# Altium schematic sheet Power_Regulators_Digital_3.SchDoc
size A4; DocumentNumber: 32; SheetNumber: 32; SheetTotal: 47
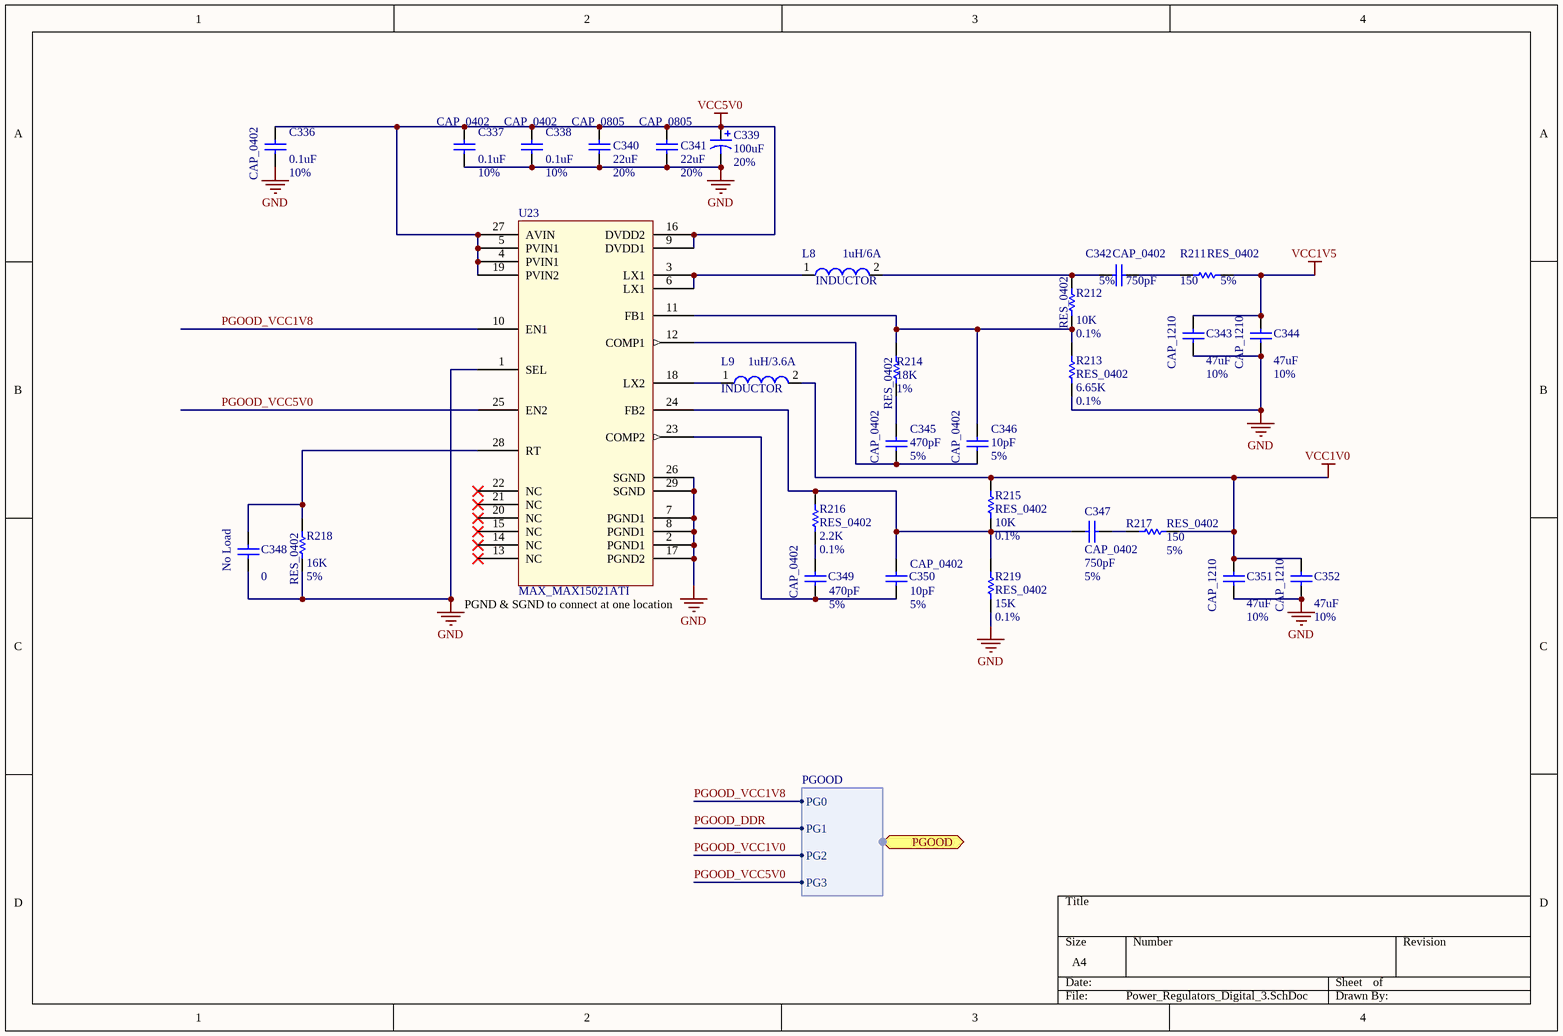
[diagram p0: Power_Regulators_Digital_3.SchDoc]

## Parts
C336  CAP_0402  value 0.1uF  Tolerance: 10%  [CAPC0402(1005)60_N]
C337  CAP_0402  value 0.1uF  Tolerance: 10%  [CAPC0402(1005)60_N]
C338  CAP_0402  value 0.1uF  Tolerance: 10%  [CAPC0402(1005)60_N]
C339  value 100uF  Tolerance: 20%  [Polarized_CAPC1210(3225)]  (hidden comment: Cap Pol1)
C340  CAP_0805  value 22uF  Tolerance: 20%  [CAPC0805(2012)75_N]
C341  CAP_0805  value 22uF  Tolerance: 20%  [CAPC0805(2012)75_N]
C342  CAP_0402  value 750pF  Tolerance: 5%  [CAPC0402(1005)60_N]
C343  CAP_1210  value 47uF  Tolerance: 10%  [CAPC1210(3225)100_N]
C344  CAP_1210  value 47uF  Tolerance: 10%  [CAPC1210(3225)100_N]
C345  CAP_0402  value 470pF  Tolerance: 5%  [CAPC0402(1005)60_N]
C346  CAP_0402  value 10pF  Tolerance: 5%  [CAPC0402(1005)60_N]
C347  CAP_0402  value 750pF  Tolerance: 5%  [CAPC0402(1005)60_N]
C348  value 0  Manufacturer: No Load  [CAPC0201(0603)33_N]  (hidden comment: CAP_0201)
C349  CAP_0402  value 470pF  Tolerance: 5%  [CAPC0402(1005)60_N]
C350  CAP_0402  value 10pF  Tolerance: 5%  [CAPC0402(1005)60_N]
C351  CAP_1210  value 47uF  Tolerance: 10%  [CAPC1210(3225)100_N]
C352  CAP_1210  value 47uF  Tolerance: 10%  [CAPC1210(3225)100_N]
L8  INDUCTOR  value 1uH/6A  [Inductor_SRN6045-Series_2-PIN]
L9  INDUCTOR  value 1uH/3.6A  [Inductor_NRS5020T1R0NMGJ_2-PIN]
R211  RES_0402  value 150  Tolerance: 5%  [RESC0402(1005)_N]
R212  RES_0402  value 10K  Tolerance: 0.1%  [RESC0402(1005)_N]
R213  RES_0402  value 6.65K  Tolerance: 0.1%  [RESC0402(1005)_N]
R214  RES_0402  value 18K  Tolerance: 1%  [RESC0402(1005)_N]
R215  RES_0402  value 10K  Tolerance: 0.1%  [RESC0402(1005)_N]
R216  RES_0402  value 2.2K  Tolerance: 0.1%  [RESC0402(1005)_N]
R217  RES_0402  value 150  Tolerance: 5%  [RESC0402(1005)_N]
R218  RES_0402  value 16K  Tolerance: 5%  [RESC0402(1005)_N]
R219  RES_0402  value 15K  Tolerance: 0.1%  [RESC0402(1005)_N]
U23  MAX_MAX15021ATI  [MAX_MAX15021ATI_28TQFN_T2855-6]

## Ports
PGOOD (harness PGOOD)

## Harnesses
PGOOD: PG0, PG1, PG2, PG3

## Nets
GND: C336.1 C337.1 C338.1 C339.2 C340.1 C341.1 C343.1 C344.1 C348.1 C351.1 C352.1 R213.1 R218.2 R219.1 U23.1(SEL) U23.2(PGND1) U23.7(PGND1) U23.8(PGND1) U23.17(PGND2) U23.26(SGND) U23.29(SGND)
VCC1V0: C351.2 C352.2 L9.2 R215.2 R217.2
VCC1V5: C343.2 C344.2 R211.2
VCC5V0: C336.2 C337.2 C338.2 C339.1 C340.2 C341.2 U23.4(PVIN1) U23.5(PVIN1) U23.9(DVDD1) U23.16(DVDD2) U23.19(PVIN2) U23.27(AVIN)
PGOOD_DDR: port PGOOD.PG1
PGOOD_VCC1V0: port PGOOD.PG2
PGOOD_VCC1V8: U23.10(EN1) ; port PGOOD.PG0
PGOOD_VCC5V0: U23.25(EN2) ; port PGOOD.PG3
NetC342_1: C342.1 L8.2 R212.2
NetC342_2: C342.2 R211.1
NetC345_1: C345.1 C346.1 U23.12(COMP1)
NetC345_2: C345.2 R214.1
NetC346_2: C346.2 R212.1 R213.2 R214.2 U23.11(FB1)
NetC347_1: C347.1 C350.2 R215.1 R216.2 R219.2 U23.24(FB2)
NetC347_2: C347.2 R217.1
NetC348_2: C348.2 R218.1 U23.28(RT)
NetC349_1: C349.1 C350.1 U23.23(COMP2)
NetC349_2: C349.2 R216.1
NetL8_1: L8.1 U23.3(LX1) U23.6(LX1)
NetL9_1: L9.1 U23.18(LX2)

Not connected (* = marked no-connect by the designer): U23 13(NC)* 14(NC)* 15(NC)* 20(NC)* 21(NC)* 22(NC)*

## Notes on the sheet
- (near U23) PGND & SGND to connect at one location

## Library data of the parts
C336-C338 = C1005X5R0J104K: 0.1uf, ceramic, 10%, 6.3V, X5R, 0402; Manufacturer: TDK Corporation; Part Number: C1005X5R0J104K; Footprint Ref: CAPC0402(1005)60_N; Library Ref: CAP_0402
C339 = TLCT107M010XTA: 100uF, tantalum, 20% 10V, 1210; Manufacturer: AVX Corporation; Part Number: TLCT107M010XTA; Footprint Ref: Polarized_CAPC1210(3225); Library Ref: Cap Pol1
C340 C341 = JMK212BJ226MG-T: 22uF, ceramic, 20%, 6.3V, X5R, 0805; Manufacturer: Taiyo Yuden; Part Number: JMK212BJ226MG-T; Footprint Ref: CAPC0805(2012)75_N; Library Ref: CAP_0805
C342 C347 = C0402C751J3GACTU: 750pF, ceramic, 5% 25V NP0, 0402; Manufacturer: Kemet; Part Number: C0402C751J3GACTU; Footprint Ref: CAPC0402(1005)60_N; Library Ref: CAP_0402
C343 C344 C351 C352 = GRM32ER61A476KE20L: 47uF, ceramic 10% 10V, X5R, 1210; Manufacturer: Murata Electronics North America; Part Number: GRM32ER61A476KE20L; Footprint Ref: CAPC1210(3225)100_N; Library Ref: CAP_1210
C345 C349 = ECJ-0EB1E471K: 470pF, ceramic, 5%, 25V, X7R, 0402; Manufacturer: Panasonic-ECG; Part Number: ECJ-0EB1E471K; Footprint Ref: CAPC0402(1005)60_N; Library Ref: CAP_0402
C346 C350 = VJ0402A100JXACW1BC: 10pF, ceramic, 5%, 50V, NP0, 0402; Manufacturer: BC COMPONENTS; Part Number: VJ0402A100JXACW1BC; Footprint Ref: CAPC0402(1005)60_N; Library Ref: CAP_0402
C348 = No Load_0: Generic Capacitor; Tolerance: *; Part Number: No Load_0; Footprint Ref: CAPC0201(0603)33_N; Library Ref: CAP_0201
L8 = SRN6045-1R0Y: SRN6045-1R0Y, 1uH 4.2A-8.5A, CDRH6D38; Manufacturer: Bourns; Tolerance: *; Part Number: SRN6045-1R0Y; Footprint Ref: Inductor_SRN6045-Series_2-PIN; Library Ref: INDUCTOR
L9 = NRS5020T1R0NMGJ: NRS5020T1R0NMGJ, 1uH 3.6A, 5020; Manufacturer: Taiyo Yuden; Tolerance: *; Part Number: NRS5020T1R0NMGJ; Footprint Ref: Inductor_NRS5020T1R0NMGJ_2-PIN; Library Ref: INDUCTOR
R211 R217 = RC0402JR-07150RL: 150 ohm, 5% 1/16W, 0402; Manufacturer: Yageo America; Part Number: RC0402JR-07150RL; Footprint Ref: RESC0402(1005)_N; Library Ref: RES_0402
R212 R215 = ERA-2AEB103X: 10K ohm, 0.1% 1/16W, 0402; Manufacturer: Panasonic - ECG; Part Number: ERA-2AEB103X; Footprint Ref: RESC0402(1005)_N; Library Ref: RES_0402
R213 = 2-1879215-2: 6.65K ohm, 0.1% 1/16W, 0402; Manufacturer: TE Connectivity; Part Number: 2-1879215-2; Footprint Ref: RESC0402(1005)_N; Library Ref: RES_0402
R214 = MCR01MZPF1802: 18K ohm, 1% 1/16W, 0402; Manufacturer: ROHM; Part Number: MCR01MZPF1802; Footprint Ref: RESC0402(1005)_N; Library Ref: RES_0402
R216 = ERA-2AEB222X: 2.2K ohm, 0.1% 1/16W, 0402; Manufacturer: Panasonic - ECG; Part Number: ERA-2AEB222X; Footprint Ref: RESC0402(1005)_N; Library Ref: RES_0402
R218 = CRCW040216K0JNED: 16K ohm, 5% 1/16W, 0402; Manufacturer: Vishay/Dale; Part Number: CRCW040216K0JNED; Footprint Ref: RESC0402(1005)_N; Library Ref: RES_0402
R219 = ERA-2AEB153X: 15K ohm, 0.1% 1/16W, 0402; Manufacturer: Panasonic - ECG; Part Number: ERA-2AEB153X; Footprint Ref: RESC0402(1005)_N; Library Ref: RES_0402
U23 = MAX15021ATI+: MAX15021ATI, 4A/2A, 4MHz, Step-Down DC-DC Regulator, TQFN28; Manufacturer: Maxim Integrated Products; Part Number: MAX15021ATI+